# Altium project finalsensor.PrjPCB
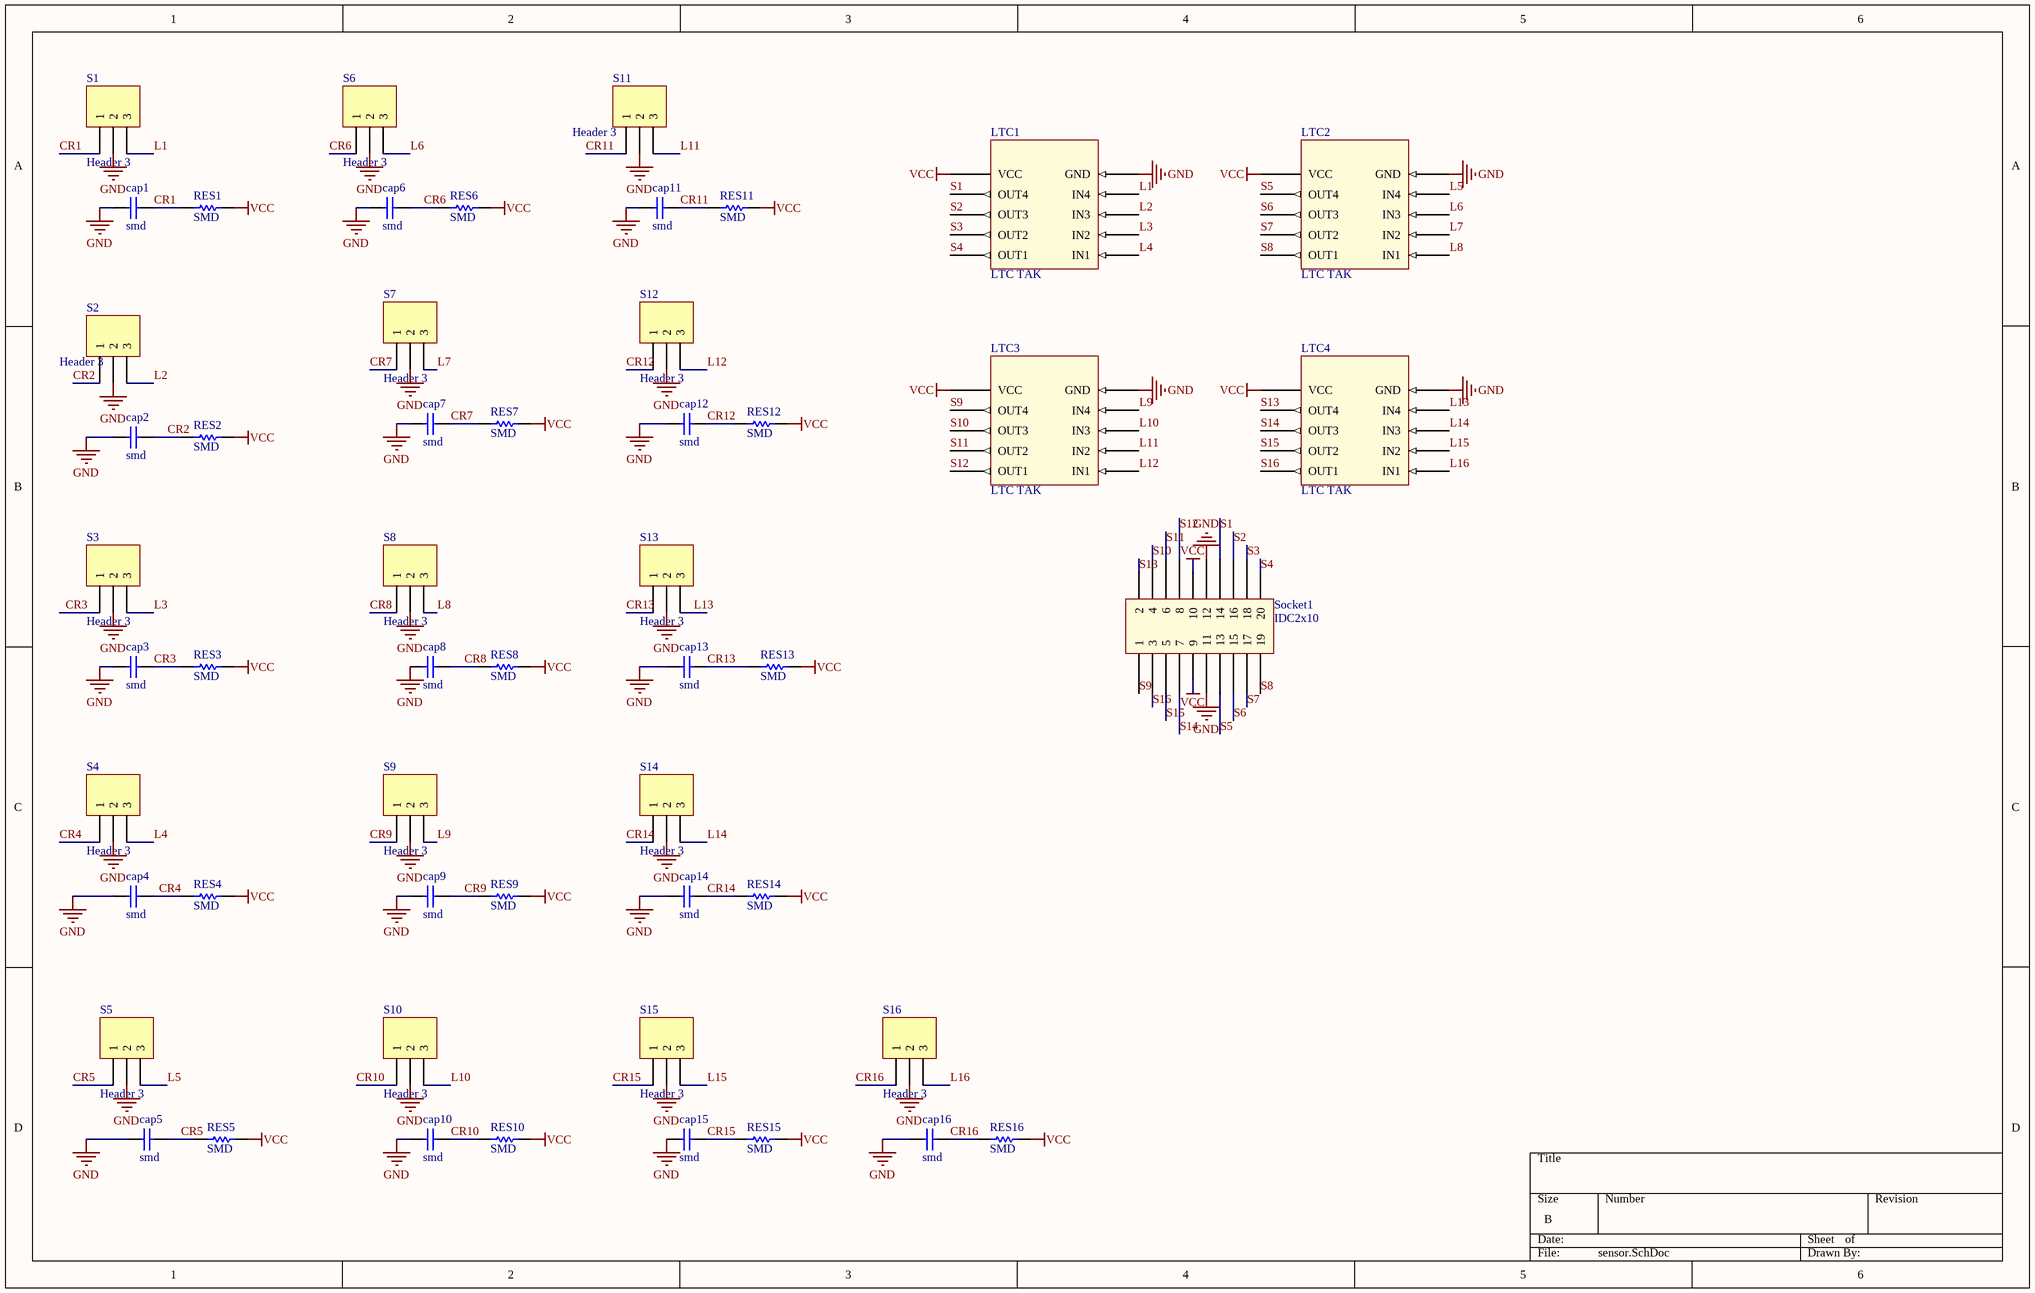
[diagram p0: sensor.SchDoc]
1 sheet, 53 parts. Net scope: global (net labels, ports and power ports of the same name join across sheets).
Board file: PCB1.PcbDoc

## Sheet sensor.SchDoc
size B

### Parts
cap1  smd  [Cap SMD]
cap2  smd  [Cap SMD]
cap3  smd  [Cap SMD]
cap4  smd  [Cap SMD]
cap5  smd  [Cap SMD]
cap6  smd  [Cap SMD]
cap7  smd  [Cap SMD]
cap8  smd  [Cap SMD]
cap9  smd  [Cap SMD]
cap10  smd  [Cap SMD]
cap11  smd  [Cap SMD]
cap12  smd  [Cap SMD]
cap13  smd  [Cap SMD]
cap14  smd  [Cap SMD]
cap15  smd  [Cap SMD]
cap16  smd  [Cap SMD]
LTC1  LTC TAK  [LTC TAK]
LTC2  LTC TAK  [LTC TAK]
LTC3  LTC TAK  [LTC TAK]
LTC4  LTC TAK  [LTC TAK]
RES1  SMD  [Resistor SMD 1206]
RES2  SMD  [Resistor SMD 1206]
RES3  SMD  [Resistor SMD 1206]
RES4  SMD  [Resistor SMD 1206]
RES5  SMD  [Resistor SMD 1206]
RES6  SMD  [Resistor SMD 1206]
RES7  SMD  [Resistor SMD 1206]
RES8  SMD  [Resistor SMD 1206]
RES9  SMD  [Resistor SMD 1206]
RES10  SMD  [Resistor SMD 1206]
RES11  SMD  [Resistor SMD 1206]
RES12  SMD  [Resistor SMD 1206]
RES13  SMD  [Resistor SMD 1206]
RES14  SMD  [Resistor SMD 1206]
RES15  SMD  [Resistor SMD 1206]
RES16  SMD  [Resistor SMD 1206]
S1  Header 3  [HDR1X3]
S2  Header 3  [HDR1X3]
S3  Header 3  [HDR1X3]
S4  Header 3  [HDR1X3]
S5  Header 3  [HDR1X3]
S6  Header 3  [HDR1X3]
S7  Header 3  [HDR1X3]
S8  Header 3  [HDR1X3]
S9  Header 3  [HDR1X3]
S10  Header 3  [HDR1X3]
S11  Header 3  [HDR1X3]
S12  Header 3  [HDR1X3]
S13  Header 3  [HDR1X3]
S14  Header 3  [HDR1X3]
S15  Header 3  [HDR1X3]
S16  Header 3  [HDR1X3]
Socket1  IDC2x10  [IDC 2x10]

### Nets
GND: cap1.1 cap2.1 cap3.1 cap4.1 cap5.1 cap6.1 cap7.1 cap8.1 cap9.1 cap10.1 cap11.1 cap12.1 cap13.1 cap14.1 cap15.1 cap16.1 LTC1.10(GND) LTC2.10(GND) LTC3.10(GND) LTC4.10(GND) S1.2 S2.2 S3.2 S4.2 S5.2 S6.2 S7.2 S8.2 S9.2 S10.2 S11.2 S12.2 S13.2 S14.2 S15.2 S16.2 Socket1.11 Socket1.12
VCC: LTC1.1(VCC) LTC2.1(VCC) LTC3.1(VCC) LTC4.1(VCC) RES1.2 RES2.2 RES3.2 RES4.2 RES5.2 RES6.2 RES7.2 RES8.2 RES9.2 RES10.2 RES11.2 RES12.2 RES13.2 RES14.2 RES15.2 RES16.2 Socket1.9 Socket1.10
CR1: cap1.2 RES1.1 S1.1
CR2: cap2.2 RES2.1 S2.1
CR3: cap3.2 RES3.1 S3.1
CR4: cap4.2 RES4.1 S4.1
CR5: cap5.2 RES5.1 S5.1
CR6: cap6.2 RES6.1 S6.1
CR7: cap7.2 RES7.1 S7.1
CR8: cap8.2 RES8.1 S8.1
CR9: cap9.2 RES9.1 S9.1
CR10: cap10.2 RES10.1 S10.1
CR11: cap11.2 RES11.1 S11.1
CR12: cap12.2 RES12.1 S12.1
CR13: cap13.2 RES13.1 S13.1
CR14: cap14.2 RES14.1 S14.1
CR15: cap15.2 RES15.1 S15.1
CR16: cap16.2 RES16.1 S16.1
L1: LTC1.9(IN4) S1.3
L2: LTC1.8(IN3) S2.3
L3: LTC1.7(IN2) S3.3
L4: LTC1.6(IN1) S4.3
L5: LTC2.9(IN4) S5.3
L6: LTC2.8(IN3) S6.3
L7: LTC2.7(IN2) S7.3
L8: LTC2.6(IN1) S8.3
L9: LTC3.9(IN4) S9.3
L10: LTC3.8(IN3) S10.3
L11: LTC3.7(IN2) S11.3
L12: LTC3.6(IN1) S12.3
L13: LTC4.9(IN4) S13.3
L14: LTC4.8(IN3) S14.3
L15: LTC4.7(IN2) S15.3
L16: LTC4.6(IN1) S16.3
S1: LTC1.2(OUT4) Socket1.14
S2: LTC1.3(OUT3) Socket1.16
S3: LTC1.4(OUT2) Socket1.18
S4: LTC1.5(OUT1) Socket1.20
S5: LTC2.2(OUT4) Socket1.13
S6: LTC2.3(OUT3) Socket1.15
S7: LTC2.4(OUT2) Socket1.17
S8: LTC2.5(OUT1) Socket1.19
S9: LTC3.2(OUT4) Socket1.1
S10: LTC3.3(OUT3) Socket1.4
S11: LTC3.4(OUT2) Socket1.6
S12: LTC3.5(OUT1) Socket1.8
S13: LTC4.2(OUT4) Socket1.2
S14: LTC4.3(OUT3) Socket1.7
S15: LTC4.4(OUT2) Socket1.5
S16: LTC4.5(OUT1) Socket1.3

### Library data of the parts
cap1-cap16 = Cap SMD
RES1-RES16 = Res SMD
S1-S16 = Header 3: Header, 3-Pin; LatestRevisionDate: 17-Jul-2002; LatestRevisionNote: Re-released for DXP Platform.; Publisher: Altium Limited
Socket1 = IDC 2x10